# Altium schematic sheet USB_Serial_Interface.SchDoc
size Letter; PageSetup: Record=PageOptions|CenterHorizontal=True|CenterVertical=True|PrintScale=1.00|XCorrection=1.00|YCorrection=1.00|PrintKind=1|BorderSize=5000000|LeftOffset=0|BottomOffset=0|Orientation=2|PaperLength=1000|PaperWidth=1000|Scale=100|PaperSource=7|PrintQuality=-4|MediaType=1|DitherType=10|PaperKind=Letter 8.5 x 11in|PrintScaleMode=1
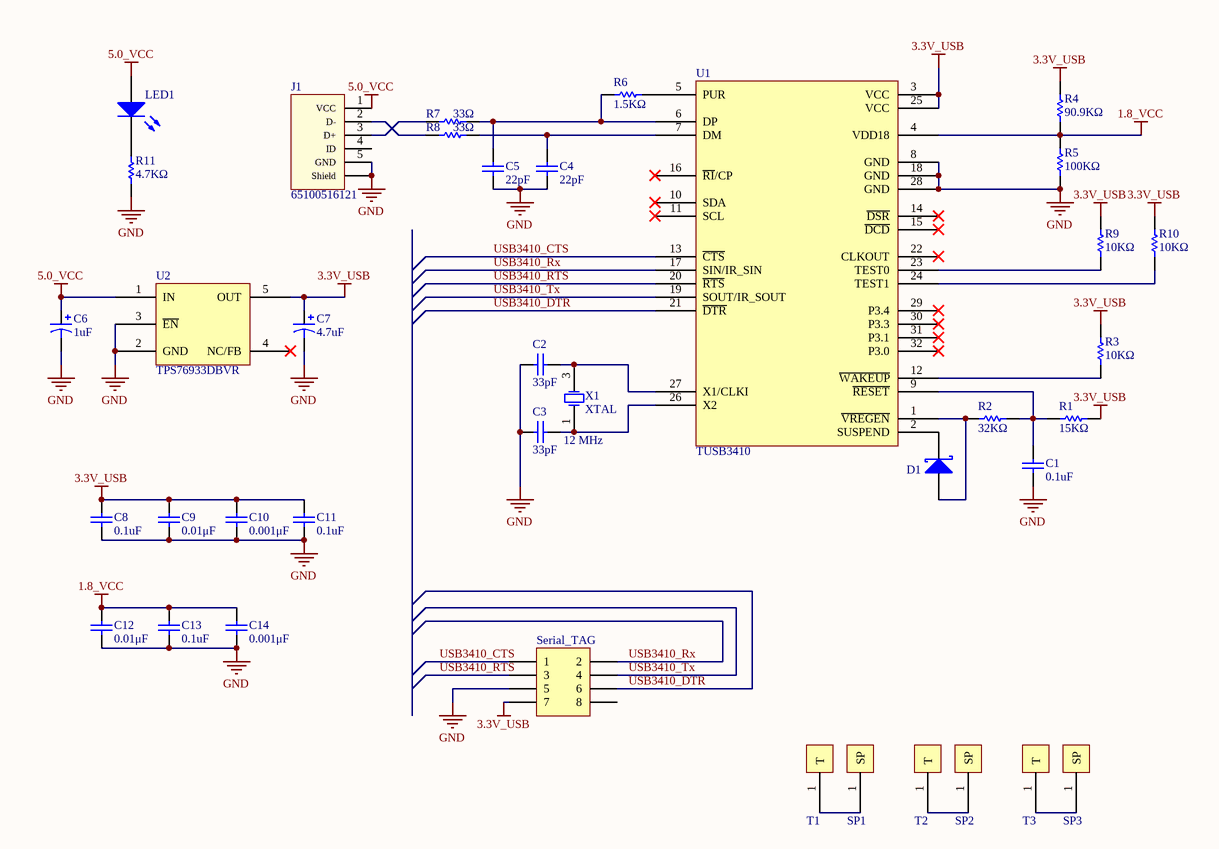
[diagram p0: USB_Serial_Interface.SchDoc]

## Parts
C1  0.1uF  [0603 - CAP]
C2  33pF  [0603 - CAP]
C3  33pF  [0603 - CAP]
C4  22pF  [0603 - CAP]
C5  22pF  [0603 - CAP]
C6  1uF  [0805-tan]
C7  4.7uF  [0805-tan]
C8  0.1uF  [0603 - CAP]
C9  0.01μF  [0603 - CAP]
C10  0.001μF  [0603 - CAP]
C11  0.1uF  [0603 - CAP]
C12  0.01μF  [0603 - CAP]
C13  0.1uF  [0603 - CAP]
C14  0.001μF  [0603 - CAP]
D1  NSR0320MW2T1G  [SOD-323]  (value not drawn)
J1  65100516121  [65100516121]
LED1  LED1  [0805-LEDG]  (value not drawn)
R1  value 15KΩ  [0805-RES]  (hidden comment: Res Semi)
R2  32KΩ  [0402]
R3  value 10KΩ  [0805-RES]  (hidden comment: Res Semi)
R4  value 90.9KΩ  [0805-RES]  (hidden comment: Res Semi)
R5  100KΩ  [0805-RES]
R6  1.5KΩ  [0805-RES]
R7  value 33Ω  [0805-RES]  (hidden comment: Res Semi)
R8  value 33Ω  [0805-RES]  (hidden comment: Res Semi)
R9  value 10KΩ  [0805-RES]  (hidden comment: Res Semi)
R10  value 10KΩ  [0805-RES]  (hidden comment: Res Semi)
R11  4.7KΩ  [0805-RES]
Serial_TAG  Header 4X2  [690367290876]  (value not drawn)
SP1  (no value)  [SPACER]
SP2  (no value)  [SPACER]
SP3  (no value)  [SPACER]
T1  (no value)  [Tornillo]
T2  (no value)  [Tornillo]
T3  (no value)  [Tornillo]
U1  TUSB3410  [Quad32]
U2  TPS76933DBVR  [DBV005]
X1  XTAL  value 12 MHz  [XTAL 4-SMD]

## Nets
1.8_VCC: C12.2 C13.1 C14.2 R4.2 R5.2 U1.4(VDD18)
3.3V_USB: C7.1 C8.1 C9.2 C10.2 C11.1 R1.1 R3.1 R4.1 R9.1 R10.1 Serial_TAG.7 U1.3(VCC) U1.25(VCC) U2.5(OUT)
5.0_VCC: C6.1 J1.1(VCC) LED1.1(A) U2.1(IN)
GND: C1.2 C2.2 C3.2 C4.2 C5.2 C6.2 C7.2 C8.2 C9.1 C10.1 C11.2 C12.1 C13.2 C14.1 J1.5(GND) J1.Shell(Shield) R5.1 R11.1 Serial_TAG.5 U1.8(GND) U1.18(GND) U1.28(GND) U2.2(GND) U2.3(~{EN})
USB3410_CTS: Serial_TAG.1 U1.13(~{CTS})
USB3410_DTR: Serial_TAG.6 U1.21(~{DTR})
USB3410_RTS: Serial_TAG.3 U1.20(~{RTS})
USB3410_Rx: Serial_TAG.2 U1.17(SIN/IR_SIN)
USB3410_Tx: Serial_TAG.4 U1.19(SOUT/IR_SOUT)
NetC1_1: C1.1 R1.2 R2.1 U1.9(~{RESET})
NetC2_1: C2.1 U1.27(X1/CLKI) X1.3(OSC2)
NetC3_1: C3.1 U1.26(X2) X1.1(OSC1)
NetC4_1: C4.1 R8.2 U1.7(DM)
NetC5_1: C5.1 R6.1 R7.2 U1.6(DP)
NetD1_1: D1.1(A) R2.2 U1.1(~{VREGEN})
NetD1_2: D1.2(K) U1.2(SUSPEND)
NetJ1_2: J1.2(D-) R8.1
NetJ1_3: J1.3(D+) R7.1
NetLED1_2: LED1.2(K) R11.2
NetR3_2: R3.2 U1.12(~{WAKEUP})
NetR6_2: R6.2 U1.5(PUR)
NetR9_2: R9.2 U1.23(TEST0)
NetR10_2: R10.2 U1.24(TEST1)
NetSP1_1: SP1.1(SP) T1.1(T)
NetSP2_1: SP2.1(SP) T2.1(T)
NetSP3_1: SP3.1(SP) T3.1(T)

Not connected (* = marked no-connect by the designer): J1 4(ID); Serial_TAG 8; U1 10(SDA)* 11(SCL)* 14(~{DSR})* 15(~{DCD})* 16(~{RI}/CP)* 22(CLKOUT)* 29(P3.4)* 30(P3.3)* 31(P3.1)* 32(P3.0)*; U2 4(NC/FB)*

## Notes on the sheet
- Elaboró
- Fecha
- Nombre del artículo
- Revisó
- Aprobó
- Número de parte
- Revisión
- Escala
- N/A
- Sección afectada
- Descripción del cambio
- Lámina
- 1/1
- Tolerancias
- Ruta del archivo

## Library data of the parts
C1 C8 C11 C13 = Cap: CAP CERAMIC 0.1UF, 25V, X7R, 0603; Manufacturer Part Number: CGJ3E2X7R1E104K080AA; Manufacturer: TDK Corporation; Value: 0.1uF; Supplier 1: Digi-Key; Supplier Part Number 1: 445-8129-1-ND
C2 C3 = Cap: CAP CER 33PF 100V C0G/NP0 0603; Manufacturer: AVX Corporation; Manufacturer Part Number: 06031A330FAT2A; Value: 33pF; Supplier 1: Digi-Key; Supplier Part Number 1: 478-3688-1-ND
C4 C5 = Cap: CAP CER 22PF 25V C0G/NP0 0603; Manufacturer Part Number: C0603C220K3GACTU; Manufacturer: Kemet; Value: 22pF; Supplier Part Number 1: 399-9030-1-ND; Supplier 1: Digi-Key
C6 = Cap Pol1: CAP TANT 1UF 10V 10% 0805; Manufacturer: AVX Corporation; Manufacturer Part Number: TAJR105K010RNJ; Value: 1uF; Supplier 1: Digi-Key; Supplier Part Number 1: 478-3278-1-ND
C7 = Cap Pol1: CAP TANT 4.7UF 10V 10% 0805; Manufacturer Part Number: TAJR475K010RNJ; Manufacturer: AVX Corporation; Value: 4.7uF; Supplier 1: Digi-Key; Supplier Part Number 1: 478-3280-1-ND
C9 C12 = Cap: CAP CER 10000PF 16V X7R 0603; Manufacturer: Kemet; Manufacturer Part Number: C0603C103K4RACTU; Value: 0.01μF; Supplier Part Number 1: 399-7841-1-ND; Supplier 1: Digi-Key
C10 C14 = Cap: CAP CER 1000PF 16V X7R 0603; Manufacturer Part Number: 0603YC102KAT2A; Manaufacturer: AVX Corporation; Value: 0.001μF; Supplier Part Number 1: 478-7933-1-ND; Supplier 1: Digi-Key
D1 = 10MQ060N: DIODE SCHOTTKY 1A 20V SOD-323; Manufacturer: ON Semiconductor; Manufacturer Part Number: NSR0320MW2T1G; Supplier 1: Digi-Key; Supplier Part Number 1: NSR0320MW2T1GOSCT-ND
J1 = 65100516121: Mini USB 2.0 Type B SMT Horizontal 5 Contacts WR-COM; Manufaturer: Wurth Elektronik; Manufacturer Part Number: 65100516121; Supplier 1: Wurth Elektronik; Supplier Part Number 1: 65100516121; Supplier 2: Digi-Key; Supplier Part Number 2: 732-2109-1-ND
LED1 = LED2: WL-SMCW SMD mono-color chip LED waterclear 0805 Green; Manufacturer: WURTH ELEKTRONIK; Manufacturer Part Number: 150080GS75000; Supplier 2: Digi-Key; Supplier Part Number 2: 732-4983-1-ND; Supplier 3: Newark; Supplier Part Number 3: 95W3800; Supplier 1: Wurth Elektronik; Supplier Part Number 1: 150080GS75000
R1 = Res Semi: RES SMD 15K OHM 0.1% 1/4W 0805; Manufacturer: Panasonic Electronic Components; Manufacturer Part Number: ERJ-PB6B1502V; Supplier Part Number 1: P20726CT-ND; Supplier 1: Digi-Key
R2 = Res Semi: RES 32K OHM 0.1% 1/10W 0402; Manufacturer Part Number: TNPW040232K0BEED; Manufacturer: Vishay Dale; Value: 32KΩ; Supplier Part Number 1: 541-2115-1-ND; Supplier 1: Digi-Key
R3 R9 R10 = Res Semi: 10 kOhms ±5% 0.125W, 1/8W Chip Resistor 0805; Manufacturer Part Number: RC0805JR-0710KL; Manufacturer: Yageo; Supplier Part Number 1: 311-10KARCT-ND; Supplier 1: Digi-Key
R4 = Res Semi: RES SMD 90.9K OHM 0.1% 1/8W 0805; Manufacturer: Panasonic Electronic Components; Manufacturer Part Number: ERA-6AEB9092V; Supplier Part Number 1: P90.9KDACT-ND; Supplier 1: Digi-Key
R5 = Res1: RES SMD 100K OHM 0.1% 1/8W 0805; Manufacturer: Panasonic Electronic Components; Manufacturer Part Number: ERA-6AEB104V; Value: 100KΩ; Supplier 1: Digi-Key; Supplier Part Number 1: P100KDACT-ND
R6 = Res Semi: RES SMD 1.5K OHM 5% 0.4W 0805; Manufacturer: Rohm Semiconductor; Manufacturer Part Number: ESR10EZPJ152; Value: 1.5KΩ; Supplier Part Number 1: RHM1.5KKCT-ND; Supplier 1: Digi-Key
R7 R8 = Res Semi: RES SMD 33 OHM 1% 1/8W 0805; Manufacturer: Yageo; Manufacturer Part Number: RC0805FR-0733RL; Supplier Part Number 1: 311-33.0CRCT-ND; Supplier 1: Digi-Key
R11 = Res1: RES SMD 4.7K OHM 5% 1/8W 0805; Manufacturer: Yageo; Manufacturer Part Number: RC0805JR-074K7L; Value: 4.7KΩ; Supplier 1: Digi-Key; Supplier Part Number 1: 311-4.7KARCT-ND
Serial_TAG = Header 4X2: Female SMT Straight Connector with Latch and with Polarization WR-MM 8-Pin; Contraparte: 690 157 000 872; Manufacturer Part Number: 690 367 290 876; Manuacturer: Wurth Elektronik; Supplier Part Number 1: 690 367 290 876; Supplier 1: Wurth Elektronik
SP1-SP3 T1-T3 = PRUEBA: No Aplica; Numero de Parte: No Aplica
U1 = TUSB3410: Manufacturer: Texas Instruments; Manufacturer Part Number: TUSB3410IVF; Supplier Part Number 1: 296-16757-ND; Supplier 1: Digi-Key
U2 = TPS76933: Linear Voltage Regulator IC Positive Fixed 1 Output 3.3V 100mA SOT-23-5; Manufacturer: Texas Instruments; Manufacturer Part Number: TPS76933DBVT; Supplier Part Number 1: 77C1165; Supplier 1: Newark; Supplier 2: Digi-Key; Supplier Part Number 2: 296-2760-1-ND
X1 = XTAL: CRYSTAL 12.0000MHZ 18PF SMD; Manufacturer: AVX Corp/Kyocera Corp; Manufacturer Part Number: CX3225GB12000P0HPQCC; Supplier Part Number 1: 1253-1168-1-ND; Supplier 1: Digi-Key